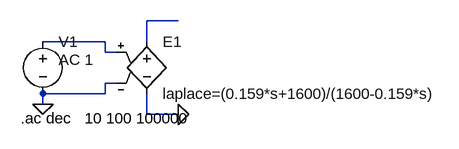
[diagram p0: schematic laplaceAPF.asc]
laplaceAPF.asc, the LTspice schematic file:
Version 4
SHEET 1 880 680
WIRE 272 96 224 96
WIRE 160 128 64 128
WIRE 224 128 224 96
WIRE 160 144 160 128
WIRE 176 144 160 144
WIRE 176 192 160 192
WIRE 160 208 160 192
WIRE 160 208 64 208
WIRE 64 224 64 208
WIRE 224 240 224 208
WIRE 272 240 224 240
FLAG 64 224 0
FLAG 272 240 0
SYMBOL voltage 64 112 R0
WINDOW 123 24 44 Left 2
WINDOW 39 0 0 Left 2
SYMATTR InstName V1
SYMATTR Value ""
SYMATTR Value2 AC 1
SYMBOL e 224 112 R0
SYMATTR InstName E1
SYMATTR Value laplace=(0.159*s+1600)/(1600-0.159*s)
TEXT 30 246 Left 2 !.ac dec   10 100 100000

The netlist it stands for:
* laplaceAPF.asc
V1 N002 0 AC 1
E1 N001 0 N002 0 laplace=(0.159*s+1600)/(1600-0.159*s)
.ac dec   10 100 100000
.backanno
.end